# Altium schematic sheet connect.SchDoc
size A
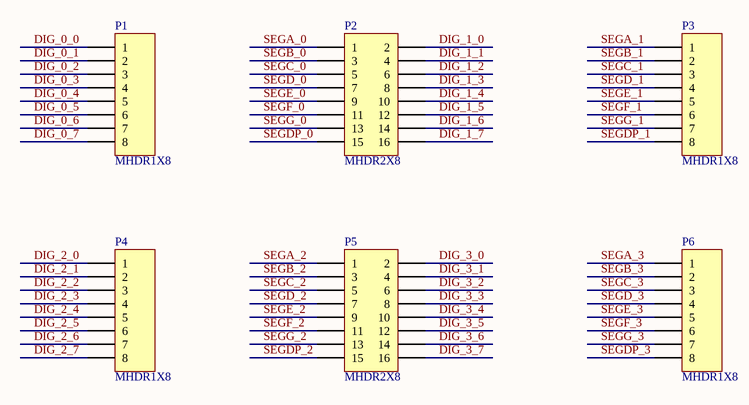
[diagram p0: connect.SchDoc]

## Parts
P1  MHDR1X8  [HDR1X8]
P2  MHDR2X8  [HDR2X8]
P3  MHDR1X8  [HDR1X8]
P4  MHDR1X8  [HDR1X8]
P5  MHDR2X8  [HDR2X8]
P6  MHDR1X8  [HDR1X8]

## Nets
DIG_0_0: P1.1
DIG_0_1: P1.2
DIG_0_2: P1.3
DIG_0_3: P1.4
DIG_0_4: P1.5
DIG_0_5: P1.6
DIG_0_6: P1.7
DIG_0_7: P1.8
DIG_1_0: P2.2
DIG_1_1: P2.4
DIG_1_2: P2.6
DIG_1_3: P2.8
DIG_1_4: P2.10
DIG_1_5: P2.12
DIG_1_6: P2.14
DIG_1_7: P2.16
DIG_2_0: P4.1
DIG_2_1: P4.2
DIG_2_2: P4.3
DIG_2_3: P4.4
DIG_2_4: P4.5
DIG_2_5: P4.6
DIG_2_6: P4.7
DIG_2_7: P4.8
DIG_3_0: P5.2
DIG_3_1: P5.4
DIG_3_2: P5.6
DIG_3_3: P5.8
DIG_3_4: P5.10
DIG_3_5: P5.12
DIG_3_6: P5.14
DIG_3_7: P5.16
SEGA_0: P2.1
SEGA_1: P3.1
SEGA_2: P5.1
SEGA_3: P6.1
SEGB_0: P2.3
SEGB_1: P3.2
SEGB_2: P5.3
SEGB_3: P6.2
SEGC_0: P2.5
SEGC_1: P3.3
SEGC_2: P5.5
SEGC_3: P6.3
SEGD_0: P2.7
SEGD_1: P3.4
SEGD_2: P5.7
SEGD_3: P6.4
SEGDP_0: P2.15
SEGDP_1: P3.8
SEGDP_2: P5.15
SEGDP_3: P6.8
SEGE_0: P2.9
SEGE_1: P3.5
SEGE_2: P5.9
SEGE_3: P6.5
SEGF_0: P2.11
SEGF_1: P3.6
SEGF_2: P5.11
SEGF_3: P6.6
SEGG_0: P2.13
SEGG_1: P3.7
SEGG_2: P5.13
SEGG_3: P6.7

## Library data of the parts
P1 P3 P4 P6 = MHDR1X8: Header, 8-Pin; LatestRevisionDate: 17-Jul-2002; LatestRevisionNote: Re-released for DXP Platform.; Publisher: Altium Limited
P2 P5 = MHDR2X8: Header, 8-Pin, Dual row; LatestRevisionDate: 17-Jul-2002; LatestRevisionNote: Re-released for DXP Platform.; Publisher: Altium Limited